# EAGLE design Schaltplan SafeScan (EAGLE 7.2.0)
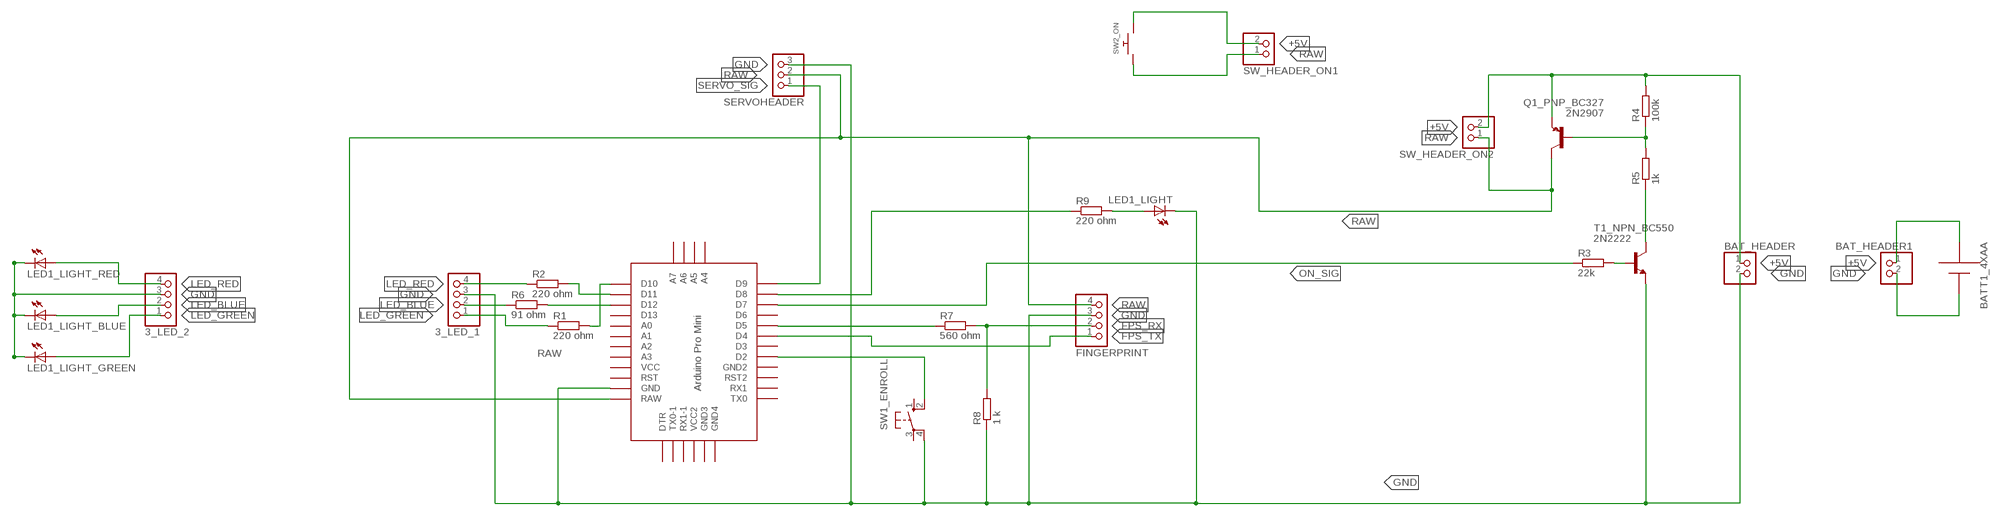
[diagram p0: schematic, sheet 1]

## Parts
3_LED_1  PINHD-1X4  [1X04]
3_LED_2  PINHD-1X4  [1X04]
ARDUINO_PRO_MINI_3.3  PRO-MINI  [PRO-MINI]
BAT_HEADER  PINHD-1X2  [1X02]
BAT_HEADER1  PINHD-1X2  [1X02]
BATT1_4XAA  AAA  [12BH412]
FINGERPRINT  PINHD-1X4  [1X04]
LED1_LIGHT  LED5MM  [LED5MM]
LED1_LIGHT_BLUE  LED5MM  [LED5MM]
LED1_LIGHT_GREEN  LED5MM  [LED5MM]
LED1_LIGHT_RED  LED5MM  [LED5MM]
Q1_PNP_BC327  2N2907  [TO92-EBC-OVAL]
R1  220 ohm  R-EU_0204/5  [0204/5]
R2  220 ohm  R-EU_0204/5  [0204/5]
R3  22k  R-EU_0204/5  [0204/5]
R4  100k  R-EU_0204/5  [0204/5]
R5  1k  R-EU_0204/5  [0204/5]
R6  91 ohm  R-EU_0204/5  [0204/5]
R7  560 ohm  R-EU_0207/15  [0207/15]
R8  1 k  R-EU_0204/5  [0204/5]
R9  220 ohm  R-EU_0204/5  [0204/5]
SERVOHEADER  PINHD-1X3CB  [1X03-CLEANBIG]
SW1_ENROLL  10-XX  [B3F-10XX]
SW2_ON  SWITCH_PUSHBUTTONEVQ-PE  [TACT_PANA-EVQ]
SW_HEADER_ON1  PINHD-1X2  [1X02]
SW_HEADER_ON2  PINHD-1X2  [1X02]
T1_NPN_BC550  2N2222  [TO92-EBC-OVAL]

## Nets
+5V: BAT_HEADER1.1 BAT_HEADER.1 BATT1_4XAA.- Q1_PNP_BC327.E R4.2 SW2_ON.P$2 SW_HEADER_ON1.2 SW_HEADER_ON2.2
FPS_RX: FINGERPRINT.2 R7.2 R8.2
FPS_TX: ARDUINO_PRO_MINI_3.3.D4 FINGERPRINT.1
GND: 3_LED_1.3 3_LED_2.3 ARDUINO_PRO_MINI_3.3.GND BAT_HEADER1.2 BAT_HEADER.2 BATT1_4XAA.+ FINGERPRINT.3 LED1_LIGHT.K(C) LED1_LIGHT_BLUE.K(C) LED1_LIGHT_GREEN.K(C) LED1_LIGHT_RED.K(C) R8.1 SERVOHEADER.3 SW1_ENROLL.4(P1) T1_NPN_BC550.E
LED_BLUE: 3_LED_1.2 3_LED_2.2 LED1_LIGHT_BLUE.A R6.1
LED_GREEN: 3_LED_1.1 3_LED_2.1 LED1_LIGHT_GREEN.A R1.1
LED_RED: 3_LED_1.4 3_LED_2.4 LED1_LIGHT_RED.A R2.1
N$2: ARDUINO_PRO_MINI_3.3.D5 R7.1
N$3: R5.1 T1_NPN_BC550.C
N$4: ARDUINO_PRO_MINI_3.3.D2 SW1_ENROLL.2(S1)
N$5: ARDUINO_PRO_MINI_3.3.D8 R9.1
N$7: ARDUINO_PRO_MINI_3.3.D10 R1.2
N$8: ARDUINO_PRO_MINI_3.3.D11 R2.2
N$11: ARDUINO_PRO_MINI_3.3.D12 R6.2
N$16: Q1_PNP_BC327.B R4.1 R5.2
N$20: LED1_LIGHT.A R9.2
N$29: R3.2 T1_NPN_BC550.B
ON_SIG: ARDUINO_PRO_MINI_3.3.D7 R3.1
RAW: ARDUINO_PRO_MINI_3.3.RAW FINGERPRINT.4 Q1_PNP_BC327.C SERVOHEADER.2 SW2_ON.P$1 SW_HEADER_ON1.1 SW_HEADER_ON2.1
SERVO_SIG: ARDUINO_PRO_MINI_3.3.D9 SERVOHEADER.1
Unconnected: ARDUINO_PRO_MINI_3.3.A0 ARDUINO_PRO_MINI_3.3.A1 ARDUINO_PRO_MINI_3.3.A2 ARDUINO_PRO_MINI_3.3.A3 ARDUINO_PRO_MINI_3.3.A4 ARDUINO_PRO_MINI_3.3.A5 ARDUINO_PRO_MINI_3.3.A6 ARDUINO_PRO_MINI_3.3.A7 ARDUINO_PRO_MINI_3.3.D3 ARDUINO_PRO_MINI_3.3.D6 ARDUINO_PRO_MINI_3.3.D13 ARDUINO_PRO_MINI_3.3.DTR ARDUINO_PRO_MINI_3.3.GND1(GND2) ARDUINO_PRO_MINI_3.3.GND2(GND4) ARDUINO_PRO_MINI_3.3.GND3 ARDUINO_PRO_MINI_3.3.RST ARDUINO_PRO_MINI_3.3.RST1(RST2) ARDUINO_PRO_MINI_3.3.RX1 ARDUINO_PRO_MINI_3.3.RX1-1 ARDUINO_PRO_MINI_3.3.TX0 ARDUINO_PRO_MINI_3.3.TX0-1 ARDUINO_PRO_MINI_3.3.VCC ARDUINO_PRO_MINI_3.3.VCC1(VCC2) SW1_ENROLL.1(S) SW1_ENROLL.3(P)

## Library data of the parts
3_LED_1 3_LED_2 FINGERPRINT = pinhead:PINHD-1X4: PIN HEADER
ARDUINO_PRO_MINI_3.3 = Arduino-clone:PRO-MINI: Arduion Pro Mini Clone V1.0 www.betemcu.cu
BAT_HEADER BAT_HEADER1 SW_HEADER_ON1 SW_HEADER_ON2 = pinhead:PINHD-1X2: PIN HEADER
BATT1_4XAA = adafruit:AAA: AAA PC pin holder Mouser part #12BH412 - but pretty much any 1x AAA battery holder should be the same http://www.ladyada.net/library/pcb/eaglelibrary.html
LED1_LIGHT LED1_LIGHT_BLUE LED1_LIGHT_GREEN LED1_LIGHT_RED = adafruit:LED: LED OSRAM: - CHIPLED LG R971, LG N971, LY N971, LG Q971, LY Q971, LO R971, LY R971 LH N974, LH R974 LS Q976, LO Q976, LY Q976 LO Q996 - Hyper CHIPLED LW Q18S LB Q993, LB Q99A, LB R99A - SideLED LS A670, LO A670, LY A670, LG A670, LP A670 LB A673, LV A673, LT A673, LW A673 LH A674 LY A675 LS A676, LA A676, LO A676, LY A676, LW A676 LS A679, LY A679, LG A679 - Hyper Micro SIDELED® LS Y876, LA Y876, LO Y876, LY Y876 LT Y87S - SmartLED LW L88C, LW L88S LB L89C, LB L89S, LG L890 LS L89K, LO L89K, LY L89K LS L896, LA L896, LO L896, LY L896 - TOPLED LS T670, LO T670, LY T670, LG T670, LP T670 LSG T670, LSP T670, LSY T670, LOP T670, LYG T670 LG T671, LOG T671, LSG T671 LB T673, LV T673, LT T673, LW T673 LH T674 LS T676, LA T676, LO T676, LY T676, LB T676, LH T676, LSB T676, LW T676 LB T67C, LV T67C, LT T67C, LS T67K, LO T67K, LY T67K, LW E67C LS E67B, LA E67B, LO E67B, LY E67B, LB E67C, LV E67C, LT E67C LW T67C LS T679, LY T679, LG T679 LS T770, LO T770, LY T770, LG T770, LP T770 LB T773, LV T773, LT T773, LW T773 LH T774 LS E675, LA E675, LY E675, LS T675 LS T776, LA T776, LO T776, LY T776, LB T776 LHGB T686 LT T68C, LB T68C - Hyper Mini TOPLED® LB M676 - Mini TOPLED Santana® LG M470 LS M47K, LO M47K, LY M47K Source: http://www.osram.convergy.de/
Q1_PNP_BC327 = adafruit:2N2907*: PNP Transistor Big Oval pads
R1-R9 = resistor:R-EU_: RESISTOR, European symbol
SERVOHEADER = adafruit:PINHD-1X3: PIN HEADER
SW1_ENROLL = switch-omron:10-XX: OMRON SWITCH; MPN: B3F-1000; OC_FARNELL: 176432; OC_NEWARK: 36M3542
SW2_ON = adafruit:SWITCH_PUSHBUTTON: Buttons SOFTTOUCHSMD_SJ - Soft touch temporary push button (Super Junk Akihabara) Compatible with SKPMANE010 [Mouser: 688-SKPMAN] C&K_KSS = Digikey: KSS221GLFS
T1_NPN_BC550 = adafruit:2N2222: NPN TRANSISTOR Big oval pads

## Net classes
0 default: clearance 0.205 mm

## Board
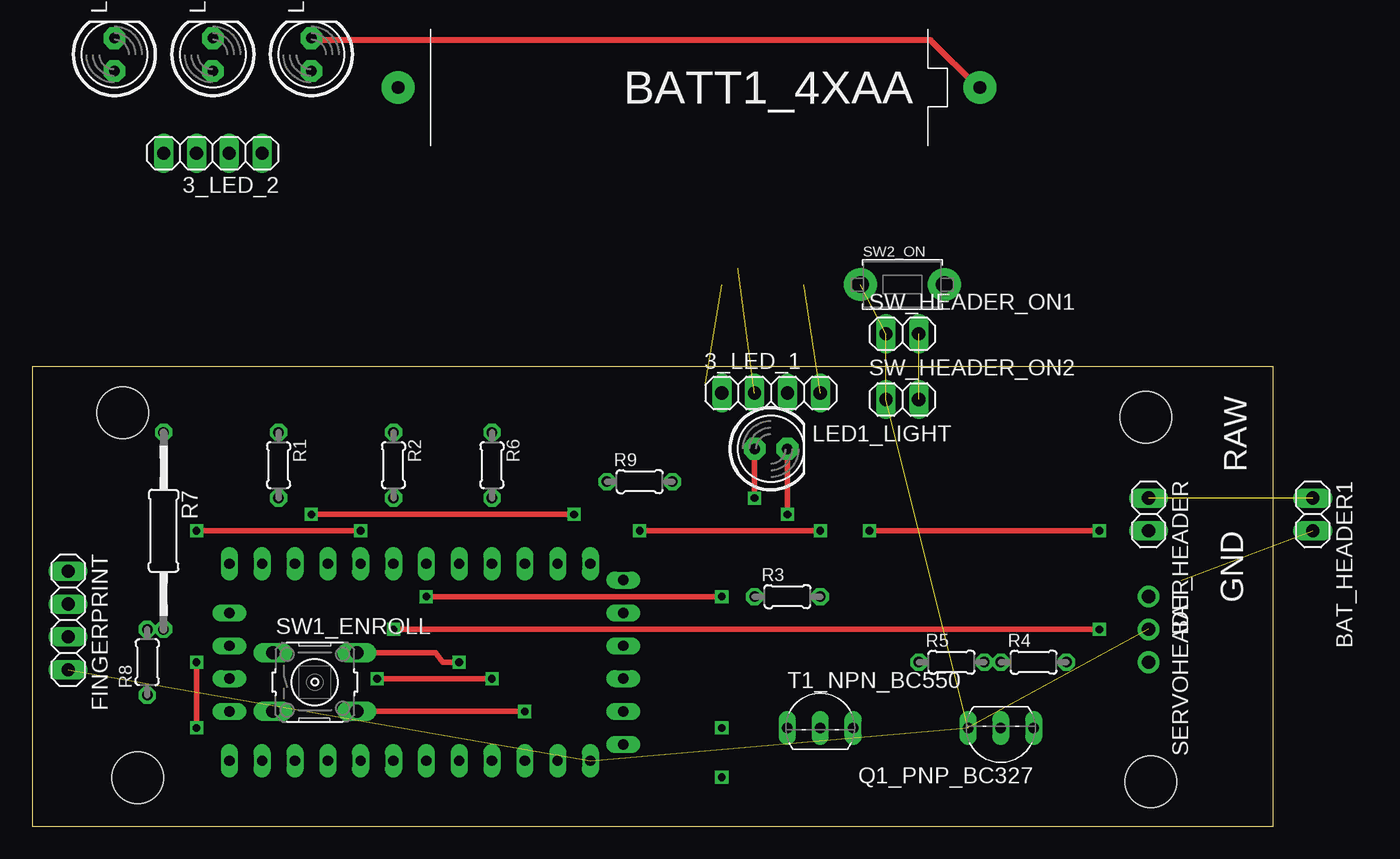
[diagram p1: board, top side]
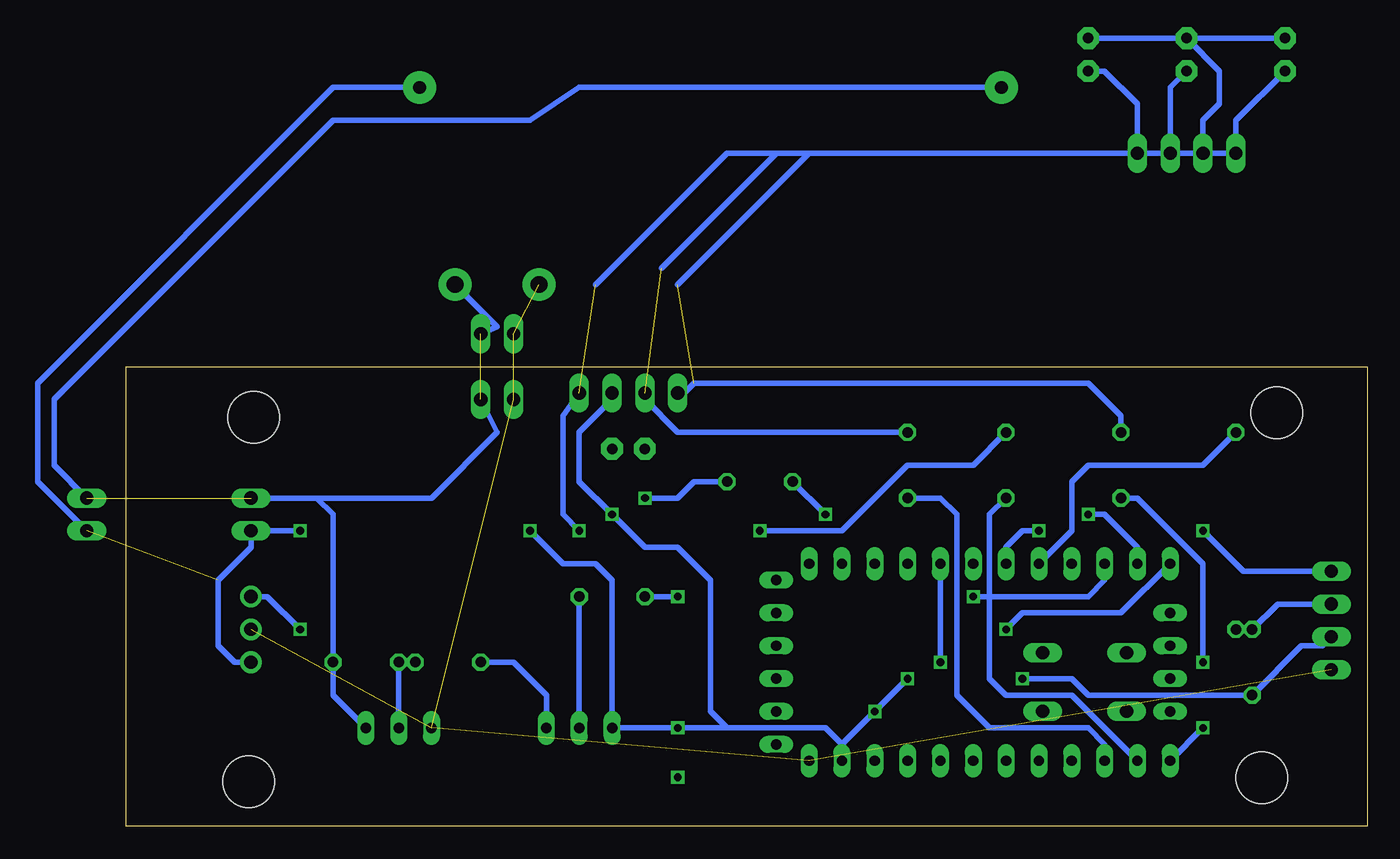
[diagram p2: board, bottom side, seen from below]

Size 96.03 x 35.55 mm. Coordinates in mm from the lower left corner, seen from the top.
Outline: 0,0 96.03,0 96.03,35.55 0,35.55 0,0
Copper layers (1*16): Top 0.035mm / dielectric 1.5mm / Bottom 0.035mm
Design rules "default *": minimum track width 18mil, minimum drill 24mil, track to track 18mil, track to pad 18mil, pad to pad 18mil, via to via 18mil, smd to smd 18mil, copper to edge 40mil, drill to drill 8mil, minimum pad ring 10mil, minimum via ring 8mil, stop-mask expansion 4mil, vias tented up to drill 0mil, thermal gap 10mil
Holes 4 mm at 7,32 8.15,3.75 86.53,3.44 86.17,31.63

### Footprints (pad centres in the part's own frame; a part is rotated, then mirrored left to right if it is on the bottom)
1X04 = drill 1.016 long: 1 -3.81,0; 2 -1.27,0; 3 1.27,0; 4 3.81,0
PRO-MINI = drill 0.8 long: A0 8.89,8.89; A1 8.89,11.43; A2 8.89,13.97; A3 8.89,16.51; A4 -2.54,-1.27; A5 0,-1.27; A6 2.54,-1.27; A7 5.08,-1.27; D2 -6.35,16.51; D3 -6.35,13.97; D4 -6.35,11.43; D5 -6.35,8.89; D6 -6.35,6.35; D7 -6.35,3.81; D8 -6.35,1.27; D9 -6.35,-1.27; D10 8.89,-1.27; D11 8.89,1.27; D12 8.89,3.81; D13 8.89,6.35; DTR 7.62,29.21; GND 8.89,24.13; GND1 -6.35,19.05; GND2 -5.08,29.21; GND3 -2.54,29.21; RAW 8.89,26.67; RST 8.89,21.59; RST1 -6.35,21.59; RX1 -6.35,24.13; RX1-1 2.54,29.21; TX0 -6.35,26.67; TX0-1 5.08,29.21; VCC 8.89,19.05; VCC1 0,29.21
1X02 = drill 1.016 long: 1 -1.27,0; 2 1.27,0
12BH412 = drill 1 pad 2.54: + 22.5,0; - -22.5,0
LED5MM = drill 0.813 pad 1.676 octagon: A -1.27,0; K 1.27,0
TO92-EBC-OVAL = drill 0.813 long: B 0,-1.27; C 2.54,-1.27; E -2.54,-1.27
0204/5 = drill 0.813 octagon: 1 -2.54,0; 2 2.54,0
0207/15 = drill 0.813 octagon: 1 -7.62,0; 2 7.62,0
1X03-CLEANBIG = drill 1.016 pad 1.676: 1 -2.54,0; 2 0,0; 3 2.54,0
B3F-10XX = drill 1.016 long: 1 -3.251,2.261; 2 3.251,2.261; 3 -3.251,-2.261; 4 3.251,-2.261
TACT_PANA-EVQ = drill 1.3 pad 2.54: P$1 -3.25,0; P$2 3.25,0

### Placement (x,y rotation side)
3_LED_1  57.15,33.52 0 top
3_LED_2  13.97,52.07 180 top  (outside the outline)
ARDUINO_PRO_MINI_3.3  16.51,13.97 270 top
BAT_HEADER  86.36,24.13 270 top
BAT_HEADER1  99.06,24.13 270 top  (outside the outline)
BATT1_4XAA  50.8,57.15 0 top  (outside the outline)
FINGERPRINT  2.77,15.93 270 top
LED1_LIGHT  57.15,29.21 0 top
LED1_LIGHT_BLUE  13.97,59.69 90 top  (outside the outline)
LED1_LIGHT_GREEN  21.59,59.69 90 top  (outside the outline)
LED1_LIGHT_RED  6.35,59.69 90 top  (outside the outline)
Q1_PNP_BC327  74.93,6.35 180 top
R1  19.05,27.94 270 top
R2  27.94,27.94 270 top
R3  58.42,17.78 0 top
R4  77.47,12.7 0 top
R5  71.12,12.7 0 top
R6  35.56,27.94 270 top
R7  10.16,22.86 270 top
R8  8.89,12.7 90 top
R9  46.99,26.67 0 top
SERVOHEADER  86.36,15.24 270 top
SW1_ENROLL  21.86,11.16 0 top
SW2_ON  67.31,41.91 0 top  (outside the outline)
SW_HEADER_ON1  67.31,38.1 0 top
SW_HEADER_ON2  67.31,33.02 0 top
T1_NPN_BC550  60.96,8.89 0 top

### Tracks (layer width: path | path; a pad name or v marks a point on that pad's centre or on a via)
+5V  (2 unrouted)
  Bottom 0.406: BATT1_4XAA.- 60.96,57.15 64.77,54.61 80.01,54.61 101.6,33.02 101.6,27.94 BAT_HEADER1.1 | Q1_PNP_BC327.E 80.01,10.16 R4.2 80.01,24.13 81.28,25.4 BAT_HEADER.1 72.39,25.4 67.31,30.48 SW_HEADER_ON2.2 | SW_HEADER_ON1.2 67.31,38.66 SW2_ON.P$2
FPS_RX
  Bottom 0.406: FINGERPRINT.2 6.93,17.2 R8.2 R7.2
FPS_TX  (via drill 0.6)
  Top 0.406: v12.7,22.86 v25.4,22.86
  Bottom 0.406: FINGERPRINT.1 9.58,19.74 v12.7,22.86 | v25.4,22.86 26.67,22.86 27.94,21.59 ARDUINO_PRO_MINI_3.3.D4
GND  (via drill 0.6)  (1 unrouted)
  Top 0.406: SW1_ENROLL.4 36.82,8.9 v38.1,8.89 | LED1_LIGHT.K v58.42,24.13 | v82.55,22.86 v64.77,22.86 | v26.67,11.43 v35.56,11.43
  Top 0.457: LED1_LIGHT_GREEN.K 21.95,60.81 69.49,60.81 73.15,57.15 BATT1_4XAA.+
  Bottom 0.406: LED1_LIGHT_GREEN.K LED1_LIGHT_BLUE.K | LED1_LIGHT_BLUE.K LED1_LIGHT_RED.K | LED1_LIGHT_BLUE.K 11.43,58.42 11.43,55.88 12.7,54.61 3_LED_2.3 | BATT1_4XAA.+ 80.01,57.15 102.87,34.29 102.87,26.67 BAT_HEADER1.2 | SERVOHEADER.3 87.63,12.7 88.9,13.97 88.9,19.05 86.36,21.59 BAT_HEADER.2 v82.55,22.86 | 40.64,6.35 v38.09,8.9 38.08,8.89 v38.1,8.89 v35.56,11.43 | 40.64,6.35 ARDUINO_PRO_MINI_3.3.GND | FINGERPRINT.3 3.46,13.97 5.08,13.97 R8.1 21.59,10.16 22.86,11.43 v26.67,11.43 | 49.53,7.62 v53.34,7.62 T1_NPN_BC550.E 58.42,19.05 59.69,20.32 62.23,20.32 v64.77,22.86 | 49.53,7.62 41.91,7.62 40.64,6.35 | 49.53,7.62 50.8,8.89 50.8,19.05 53.34,21.59 55.88,21.59 v58.42,24.13 60.96,26.67 60.96,30.48 58.42,33.02 3_LED_1.3
LED_BLUE  (1 unrouted)
  Bottom 0.406: LED1_LIGHT_BLUE.A 15.24,57.15 3_LED_2.2 45.72,52.07 54.61,43.18 | 3_LED_1.2 55.88,33.02 53.34,30.48 R6.1
LED_GREEN  (1 unrouted)
  Bottom 0.406: LED1_LIGHT_GREEN.A 20.32,58.42 17.78,55.88 3_LED_2.1 43.18,52.07 53.34,41.91 | 3_LED_1.1 52.84,33.52 52.07,34.29 21.59,34.29 19.05,31.75 R1.1
LED_RED  (via drill 0.6)  (1 unrouted)
  Top 0.406: v46.99,22.86 v60.96,22.86
  Bottom 0.406: LED1_LIGHT_RED.A 10.16,54.61 3_LED_2.4 49.53,52.07 59.69,41.91 | R2.1 30.48,27.94 35.56,27.94 40.64,22.86 v46.99,22.86 | v60.96,22.86 62.23,24.13 62.23,31.75 3_LED_1.4
N$1  (via drill 0.6)
  other vias: 53.34,3.81
N$2
  Bottom 0.406: R7.1 12.7,27.94 21.59,27.94 22.86,26.67 22.86,22.86 ARDUINO_PRO_MINI_3.3.D5
N$3
  Bottom 0.406: T1_NPN_BC550.C 63.5,10.16 66.04,12.7 R5.1
N$4  (via drill 0.6)
  Top 0.406: SW1_ENROLL.2 31.2,13.42 31.75,12.7 v33.02,12.7
  Bottom 0.406: v33.02,12.7 ARDUINO_PRO_MINI_3.3.D2
N$5  (via drill 0.6)
  Top 0.406: v21.59,24.13 v41.91,24.13
  Bottom 0.406: ARDUINO_PRO_MINI_3.3.D8 17.78,21.59 20.32,24.13 v21.59,24.13 | v41.91,24.13 R9.1
N$7  (via drill 0.6)
  Top 0.406: v12.7,12.7 v12.7,7.62
  Bottom 0.406: R1.2 17.78,25.4 12.7,20.32 v12.7,12.7 | v12.7,7.62 ARDUINO_PRO_MINI_3.3.D10
N$8
  Bottom 0.406: ARDUINO_PRO_MINI_3.3.D11 22.86,10.16 27.94,10.16 29.21,11.43 29.21,24.13 R2.2
N$11
  Bottom 0.406: ARDUINO_PRO_MINI_3.3.D12 20.32,6.35 21.59,7.62 29.21,7.62 31.75,10.16 31.75,24.13 33.02,25.4 R6.2
N$16
  Bottom 0.406: Q1_PNP_BC327.B R4.1 R5.2
N$20  (via drill 0.6)
  Top 0.406: LED1_LIGHT.A v55.88,25.4
  Bottom 0.406: v55.88,25.4 53.34,25.4 52.07,26.67 R9.2
N$29
  Bottom 0.406: T1_NPN_BC550.B R3.2
ON_SIG  (via drill 0.6)
  Top 0.406: v30.48,17.78 v53.34,17.78
  Bottom 0.406: R3.1 v53.34,17.78 | v30.48,17.78 21.59,17.78 20.32,19.05 ARDUINO_PRO_MINI_3.3.D7
RAW  (6 unrouted)
SERVO_SIG  (via drill 0.6)
  Top 0.406: v82.55,15.24 v27.94,15.24
  Bottom 0.406: SERVOHEADER.1 85.09,17.78 v82.55,15.24 | v27.94,15.24 26.67,16.51 19.05,16.51 ARDUINO_PRO_MINI_3.3.D9

### Text on the board
tNames: RAW | GND